# EAGLE design schema_2 (EAGLE 7.7.0)
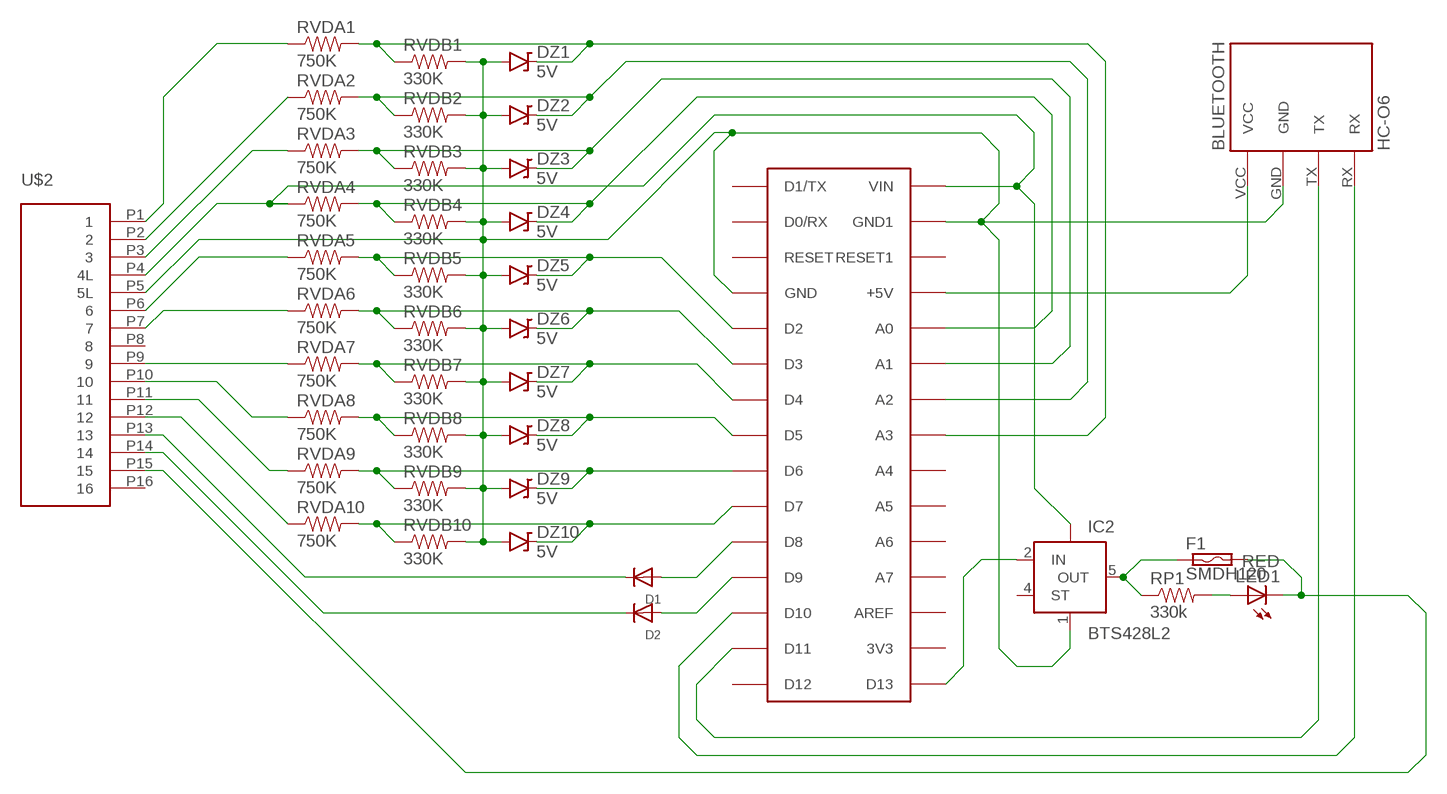
[diagram p0: schematic, sheet 1]

## Parts
BLUETOOTH  HC-O6  BLUETOOTH_BOARDSTANDING  [BT_BOARD_FOOTPRINT_STANDING]
D1  DIODESOD-123  [SOD-123]
D2  DIODESOD-123  [SOD-123]
DZ1  5V  DIODE-ZENER16V  [SOD-123]
DZ2  5V  DIODE-ZENER16V  [SOD-123]
DZ3  5V  DIODE-ZENER16V  [SOD-123]
DZ4  5V  DIODE-ZENER16V  [SOD-123]
DZ5  5V  DIODE-ZENER16V  [SOD-123]
DZ6  5V  DIODE-ZENER16V  [SOD-123]
DZ7  5V  DIODE-ZENER16V  [SOD-123]
DZ8  5V  DIODE-ZENER16V  [SOD-123]
DZ9  5V  DIODE-ZENER16V  [SOD-123]
DZ10  5V  DIODE-ZENER16V  [SOD-123]
F1  SMDH120  [SMD050F]
IC2  BTS428L2  [TO252-5-11]
LED1  RED  LED1206  [LED-1206]
RP1  330k  0.11OHM1/2W1%(2010)  [R2010]
RVDA1  750K  0.11OHM1/2W1%(2010)  [R2010]
RVDA2  750K  0.11OHM1/2W1%(2010)  [R2010]
RVDA3  750K  0.11OHM1/2W1%(2010)  [R2010]
RVDA4  750K  0.11OHM1/2W1%(2010)  [R2010]
RVDA5  750K  0.11OHM1/2W1%(2010)  [R2010]
RVDA6  750K  0.11OHM1/2W1%(2010)  [R2010]
RVDA7  750K  0.11OHM1/2W1%(2010)  [R2010]
RVDA8  750K  0.11OHM1/2W1%(2010)  [R2010]
RVDA9  750K  0.11OHM1/2W1%(2010)  [R2010]
RVDA10  750K  0.11OHM1/2W1%(2010)  [R2010]
RVDB1  330K  0.11OHM1/2W1%(2010)  [R2010]
RVDB2  330K  0.11OHM1/2W1%(2010)  [R2010]
RVDB3  330K  0.11OHM1/2W1%(2010)  [R2010]
RVDB4  330K  0.11OHM1/2W1%(2010)  [R2010]
RVDB5  330K  0.11OHM1/2W1%(2010)  [R2010]
RVDB6  330K  0.11OHM1/2W1%(2010)  [R2010]
RVDB7  330K  0.11OHM1/2W1%(2010)  [R2010]
RVDB8  330K  0.11OHM1/2W1%(2010)  [R2010]
RVDB9  330K  0.11OHM1/2W1%(2010)  [R2010]
RVDB10  330K  0.11OHM1/2W1%(2010)  [R2010]
U$1  NANO  ARDUINONANO  [PDIP-32]
U$2  OBDII_SIDEMOUNTSIDEMOUNT  [OBDII_SIDE]

## Nets
GND [ground]: BLUETOOTH.GND DZ1.A DZ2.A DZ3.A DZ4.A DZ5.A DZ6.A DZ7.A DZ8.A DZ9.A DZ10.A IC2.1(GND) RVDB1.2 RVDB2.2 RVDB3.2 RVDB4.2 RVDB5.2 RVDB6.2 RVDB7.2 RVDB8.2 RVDB9.2 RVDB10.2 U$1.GND U$1.GND1 U$2.P5(5L)
N$1 [ground]: IC2.TAB(VBB) RVDA4.1 U$1.VIN U$2.P4(4L)
N$2: RVDA1.1 U$2.P1
N$3: BLUETOOTH.TX U$1.D11
N$4: BLUETOOTH.RX U$1.D10
N$5: RVDA2.1 U$2.P2
N$6: RVDA3.1 U$2.P3
N$7: DZ5.C RVDA5.2 RVDB5.1 U$1.D2
N$8: DZ6.C RVDA6.2 RVDB6.1 U$1.D3
N$9: DZ7.C RVDA7.2 RVDB7.1 U$1.D4
N$10: DZ8.C RVDA8.2 RVDB8.1 U$1.D5
N$11: DZ2.C RVDA2.2 RVDB2.1 U$1.A2
N$12: DZ3.C RVDA3.2 RVDB3.1 U$1.A1
N$13: DZ4.C RVDA4.2 RVDB4.1 U$1.A0
N$14: BLUETOOTH.VCC U$1.+5V
N$15: LED1.A RP1.2
N$16: IC2.2(IN) U$1.D13
N$17: F1.1 IC2.5(OUT) RP1.1
N$18: F1.2 LED1.C U$2.P15
N$20: DZ9.C RVDA9.2 RVDB9.1 U$1.D6
N$21: DZ10.C RVDA10.2 RVDB10.1 U$1.D7
N$22: D1.A U$1.D8
N$23: D2.A U$1.D9
N$24 [ground]: RVDA5.1 U$2.P6
N$25 [ground]: RVDA6.1 U$2.P7
N$26 [ground]: RVDA7.1 U$2.P9
N$27 [ground]: RVDA8.1 U$2.P10
N$28 [ground]: RVDA9.1 U$2.P11
N$29 [ground]: RVDA10.1 U$2.P12
N$32: D2.C U$2.P14
N$33: D1.C U$2.P13
N$37: DZ1.C RVDA1.2 RVDB1.1 U$1.A3
Unconnected: IC2.4(ST) U$1.3V3 U$1.A4 U$1.A5 U$1.A6 U$1.A7 U$1.AREF U$1.D0/RX U$1.D1/TX U$1.D12 U$1.RESET U$1.RESET1 U$2.P8 U$2.P16

## Library data of the parts
BLUETOOTH = Bluetooth HC-05:BLUETOOTH_BOARD: Bluetooth Board V1.05
D1 D2 = adafruit:DIODE: Diode SMADIODE - SMA Surface Mount Package 20V 1A Schottky Diode Digikey: 641-1014-6-ND DO-1N4148 - Through Hole Small Current Diode SOD-123 20V 1 A (.5mV Vf) Schottky Diode - Digikey: MBRX120TPMSCT-ND SOD-323 10V 570mA (.38mV Vf, 3ns) Schottky Diode - Digikey: ZLLS410CT-ND SOD-523 30V 30mA Schottky Diode (RB751S-40TE61) - Digikey: RB751S-40TE61CT-ND SOT23-R/W - SOT23 Package (R = Solder Paste/Reflow Ovens, W = Hand-Soldering) BAT54Film 40V 300mA - Digikey: 497-7162-1-ND
DZ1-DZ10 = SparkFun-DiscreteSemi:DIODE-ZENER: Zener Diode Production Part - 8199 3.4V Zener Voltage; PROD_ID: DIO-12440; VALUE: 16V
F1 = switch-raychem:SMDH120: PolySwitch (TM) Resettable Device Source: Data sheet <http://www.farnell.com/datasheets/13482.pdf>
IC2 = infineon:BTS428L2: Smart High-Side Power Switch One Channel: 60mOhm Status Feedback Source: Source: www.infineon.com .. BTS428L2_20030912.pdf; OC_FARNELL: unknown; OC_NEWARK: unknown
LED1 = LilyPad-Wearables:LED: LEDs Standard schematic elements and footprints for 5mm, 3mm, 1206, and 0603 sized LEDs. 5mm - Spark Fun Electronics SKU : Comp-SBL
RP1 RVDA1-RVDA10 RVDB1-RVDB10 = SparkFun-Resistors:0.11OHM1/2W1%(2010): RES-08354; PROD_ID: RES-08354
U$1 = jet-lib:ARDUINONANO; MPN: A000005; OC_NEWARK: 13T9275
U$2 = Custom parts:OBDII_SIDEMOUNT

## Module OBDII
Ports: 

### Library data of the parts

## Net classes
0 default: width 0.305 mm
1 ground: width 0.61 mm

## Board
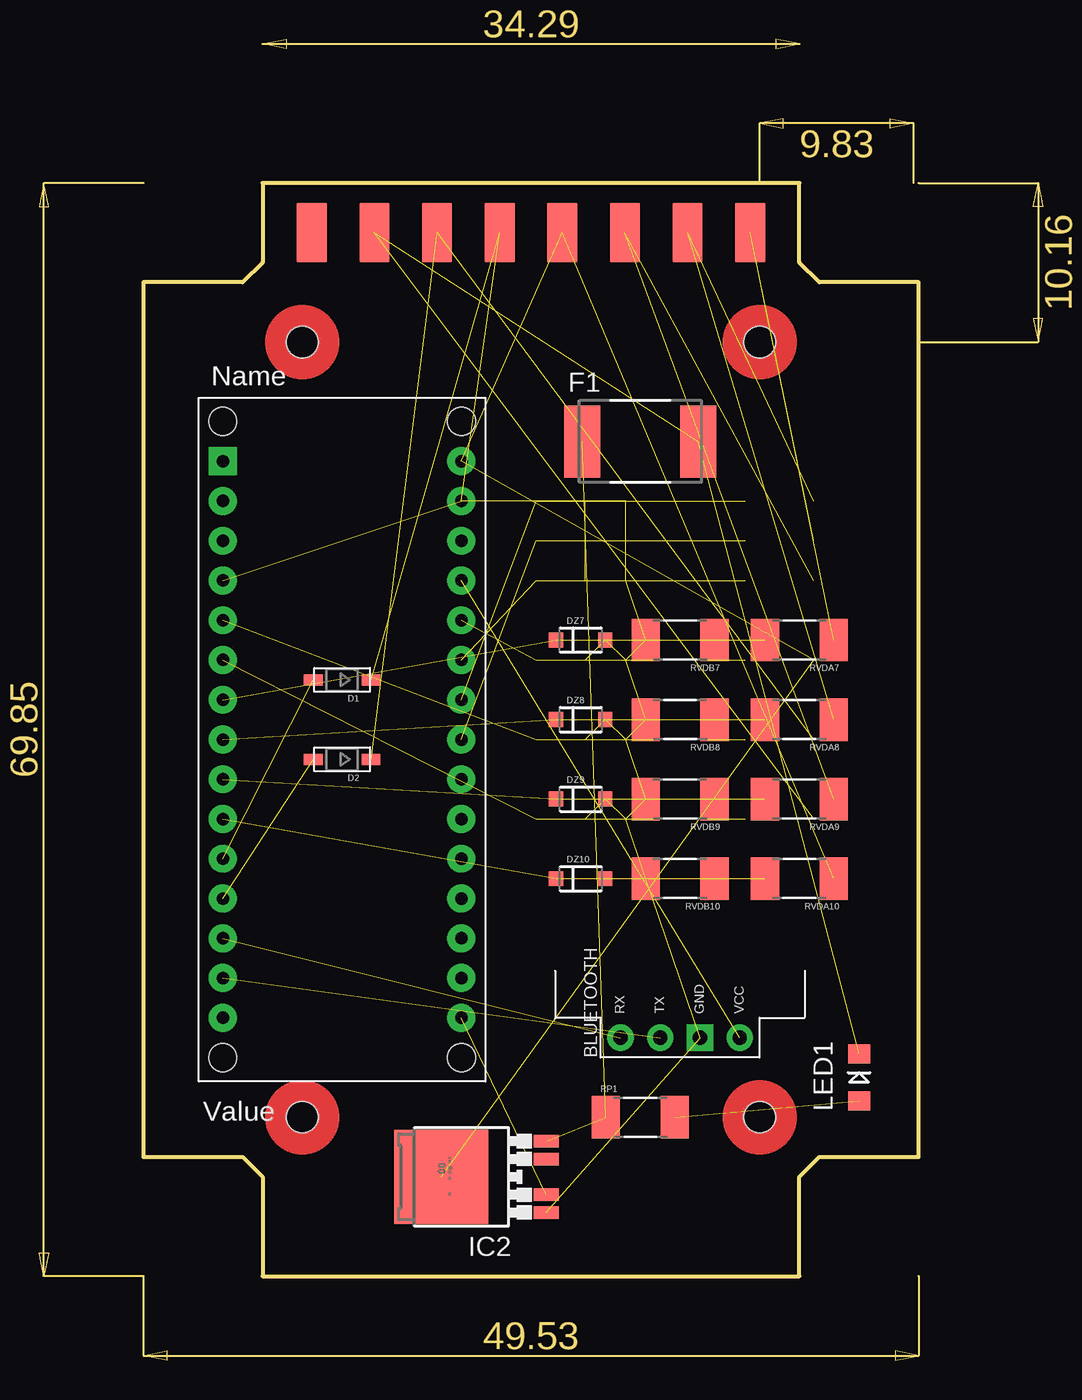
[diagram p1: board, top side]
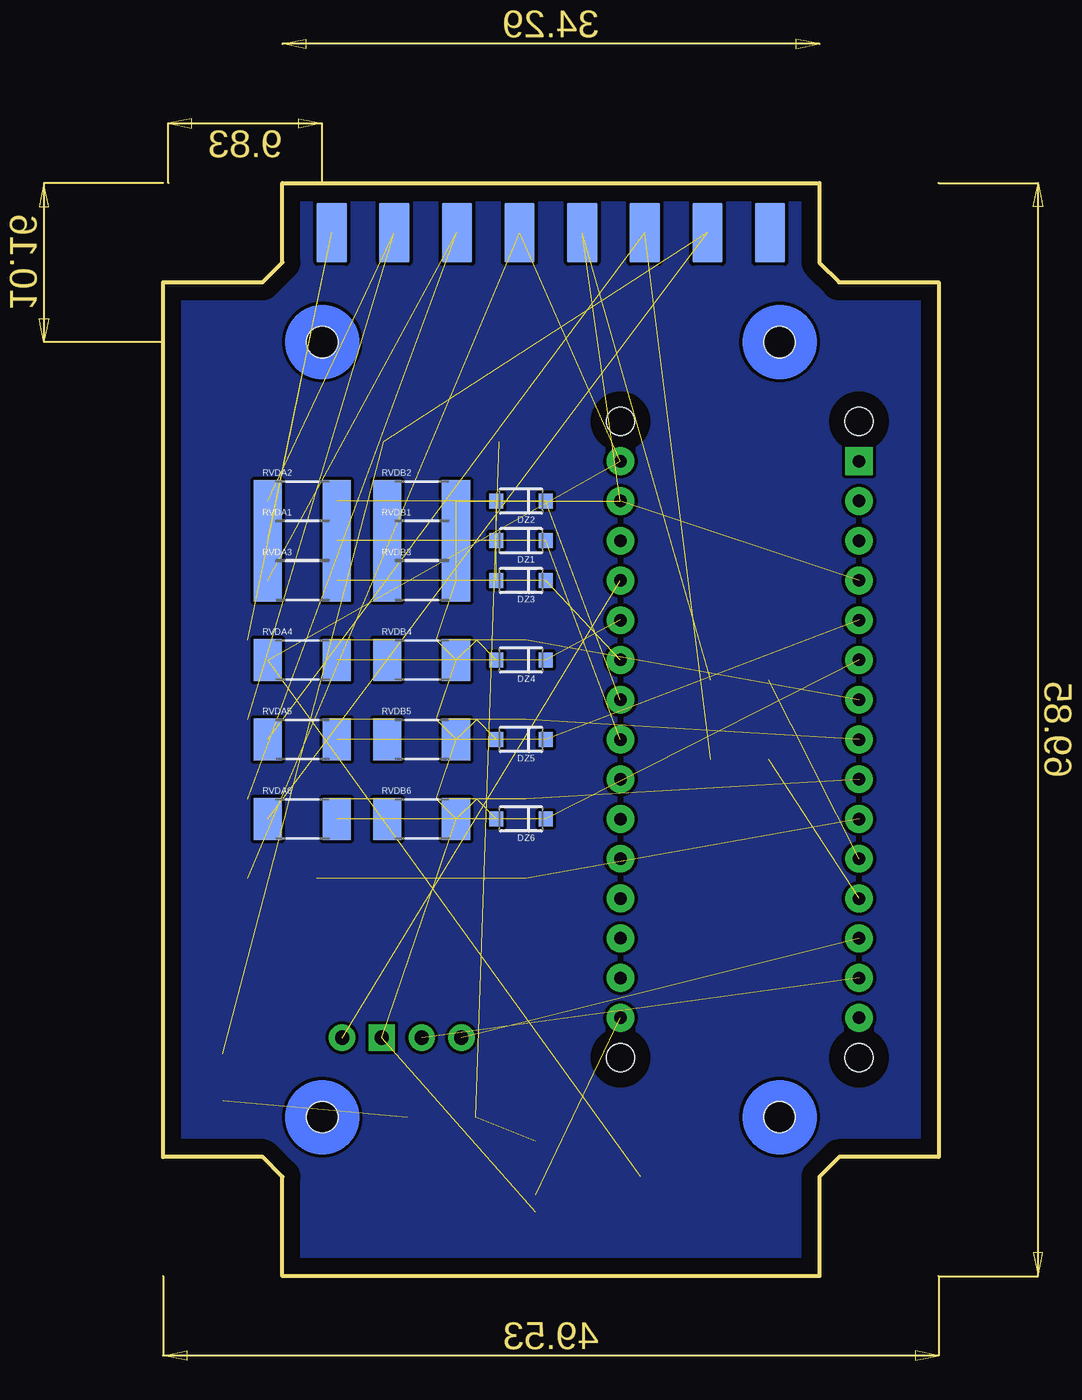
[diagram p2: board, bottom side, seen from below]

Size 49.53 x 69.85 mm. Coordinates in mm from the lower left corner, seen from the top.
Outline: 41.91,0 41.91,6.35 43.18,7.62 49.53,7.62 49.53,63.5 43.18,63.5 41.91,64.77 41.91,69.85 7.62,69.85 7.62,64.77 6.35,63.5 0,63.5 0,7.62 6.35,7.62 7.62,6.35 7.62,0 41.91,0
Copper layers (1*16): Top 0.035mm / dielectric 1.5mm / Bottom 0.035mm
Design rules "default": minimum track width 10mil, minimum drill 24mil, track to track 8mil, track to pad 8mil, pad to pad 8mil, via to via 8mil, smd to smd 8mil, copper to edge 40mil, drill to drill 8mil, minimum pad ring 10mil, minimum via ring 8mil, stop-mask expansion 4mil, vias tented up to drill 0mil, thermal gap 10mil
Holes 2 mm at 39.37,59.69 10.16,59.69 39.37,10.16 10.16,10.16

### Footprints (pad centres in the part's own frame; a part is rotated, then mirrored left to right if it is on the bottom)
BT_BOARD_FOOTPRINT_STANDING = drill 0.9 pad 1.676 square: GND -3.81,-1.27 | drill 0.9 pad 1.676: RX -3.81,3.81; TX -3.81,1.27; VCC -3.81,-3.81
SOD-123 = smd 1.2 x 0.7: A 1.85,0; C -1.85,0
SOD-123' = smd 0.9 x 0.95: A 1.575,0; C -1.575,0
SMD050F = smd 2.3 x 4.6: 1 -3.7,0; 2 3.7,0
TO252-5-11 = smd 0.8 x 1.6: 1 -2.28,-5.41; 2 -1.14,-5.41; 4 1.14,-5.41; 5 2.28,-5.41 | smd 6 x 6: TAB 0,1.3
LED-1206 = smd 1.2 x 1.4: A -1.5,0; C 1.5,0
R2010 = smd 1.8 x 2.7: 1 -2.2,0; 2 2.2,0
PDIP-32 = drill 0.8 pad 1.778: 3V3 15.24,-35.56; +5V 15.24,-10.16; A0 15.24,-12.7; A1 15.24,-15.24; A2 15.24,-17.78; A3 15.24,-20.32; A4 15.24,-22.86; A5 15.24,-25.4; A6 15.24,-27.94; A7 15.24,-30.48; AREF 15.24,-33.02; D0/RX 0,-5.08; D2 0,-12.7; D3 0,-15.24; D4 0,-17.78; D5 0,-20.32; D6 0,-22.86; D7 0,-25.4; D8 0,-27.94; D9 0,-30.48; D10 0,-33.02; D11 0,-35.56; D12 0,-38.1; D13 15.24,-38.1; GND 0,-10.16; GND1 15.24,-5.08; RESET 0,-7.62; RESET1 15.24,-7.62; VIN 15.24,-2.54 | drill 0.8 pad 1.778 square: D1/TX 0,-2.54 | hole 1.778: 0,0; 0,-40.64; 15.24,-40.64; 15.24,0
OBDII_SIDE = smd 3.81 x 1.93 bottom: P1 0,14; P2 0,10; P3 0,6; P4 0,2; P5 0,-2; P6 0,-6; P7 0,-10; P8 0,-14 | smd 3.81 x 1.93: P9 0,14; P10 0,10; P11 0,6; P12 0,2; P13 0,-2; P14 0,-6; P15 0,-10; P16 0,-14

### Placement (x,y rotation side)
BLUETOOTH  34.29,19.05 90 top
D1  12.7,38.1 180 top
D2  12.7,33.02 180 top
DZ1  5V  [SOD-123']  26.67,46.99 180 bottom
DZ2  5V  [SOD-123']  26.67,49.53 180 bottom
DZ3  5V  [SOD-123']  26.67,44.45 180 bottom
DZ4  5V  [SOD-123']  26.67,39.37 180 bottom
DZ5  5V  [SOD-123']  26.67,34.29 180 bottom
DZ6  5V  [SOD-123']  26.67,29.21 180 bottom
DZ7  5V  [SOD-123']  27.94,40.64 0 top
DZ8  5V  [SOD-123']  27.94,35.56 0 top
DZ9  5V  [SOD-123']  27.94,30.48 0 top
DZ10  5V  [SOD-123']  27.94,25.4 0 top
F1  31.75,53.34 0 top
IC2  20.32,6.35 90 top
LED1  45.72,12.7 90 top
RP1  31.75,10.16 0 top
RVDA1  40.64,46.99 0 bottom
RVDA2  40.64,49.53 0 bottom
RVDA3  40.64,44.45 0 bottom
RVDA4  40.64,39.37 0 bottom
RVDA5  40.64,34.29 0 bottom
RVDA6  40.64,29.21 0 bottom
RVDA7  41.91,40.64 180 top
RVDA8  41.91,35.56 180 top
RVDA9  41.91,30.48 180 top
RVDA10  41.91,25.4 180 top
RVDB1  33.02,46.99 0 bottom
RVDB2  33.02,49.53 0 bottom
RVDB3  33.02,44.45 0 bottom
RVDB4  33.02,39.37 0 bottom
RVDB5  33.02,34.29 0 bottom
RVDB6  33.02,29.21 0 bottom
RVDB7  34.29,40.64 180 top
RVDB8  34.29,35.56 180 top
RVDB9  34.29,30.48 180 top
RVDB10  34.29,25.4 180 top
U$1  5.08,54.61 0 top
U$2  24.77,66.67 270 top

### Tracks (layer width: path | path; a pad name or v marks a point on that pad's centre or on a via)
GND  (24 unrouted)
N$1  (3 unrouted)
N$2  (1 unrouted)
N$3  (1 unrouted)
N$4  (1 unrouted)
N$5  (1 unrouted)
N$6  (1 unrouted)
N$7  (3 unrouted)
N$8  (3 unrouted)
N$9  (3 unrouted)
N$10  (3 unrouted)
N$11  (3 unrouted)
N$12  (3 unrouted)
N$13  (3 unrouted)
N$14  (1 unrouted)
N$15  (1 unrouted)
N$16  (1 unrouted)
N$17  (2 unrouted)
N$18  (2 unrouted)
N$19
  pour Bottom: 0,7.62 5.08,7.62 6.35,7.62 7.62,6.35 7.62,0 41.91,0 41.91,6.35 43.18,7.62 49.53,7.62 49.53,63.5 43.18,63.5 41.91,64.77 41.91,69.85 7.62,69.85 7.62,64.77 6.35,63.5 0,63.5
N$20  (3 unrouted)
N$21  (3 unrouted)
N$22  (1 unrouted)
N$23  (1 unrouted)
N$24  (1 unrouted)
N$25  (1 unrouted)
N$26  (1 unrouted)
N$27  (1 unrouted)
N$28  (1 unrouted)
N$29  (1 unrouted)
N$32  (1 unrouted)
N$33  (1 unrouted)
N$37  (3 unrouted)
(copper drawn outside any net)
  shapes: Bottom circle x4, Top circle x4